# EasyEDA Pro project PCB1.epro

# Board PCB1
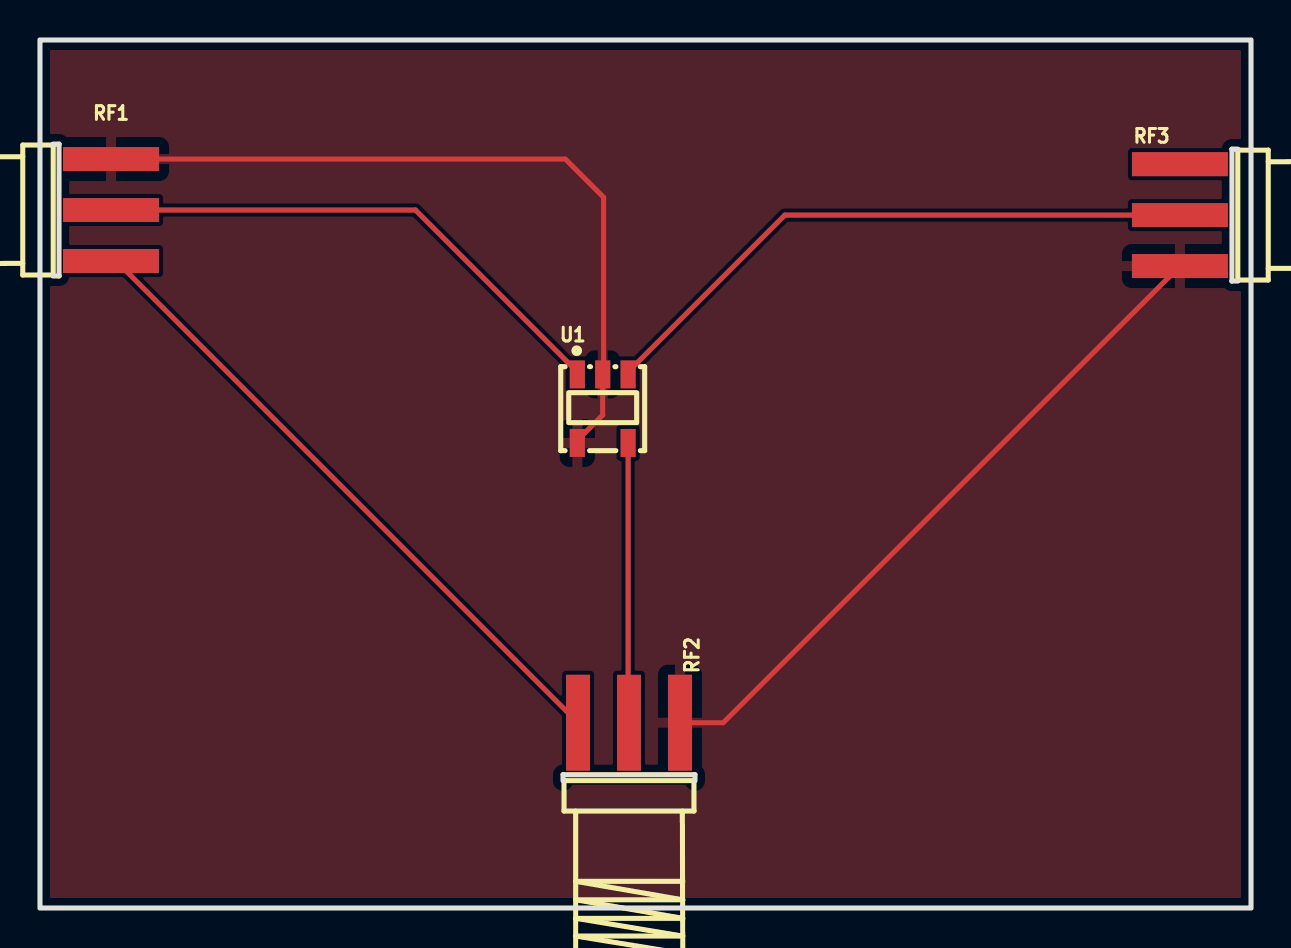
[diagram p0: board, top side]
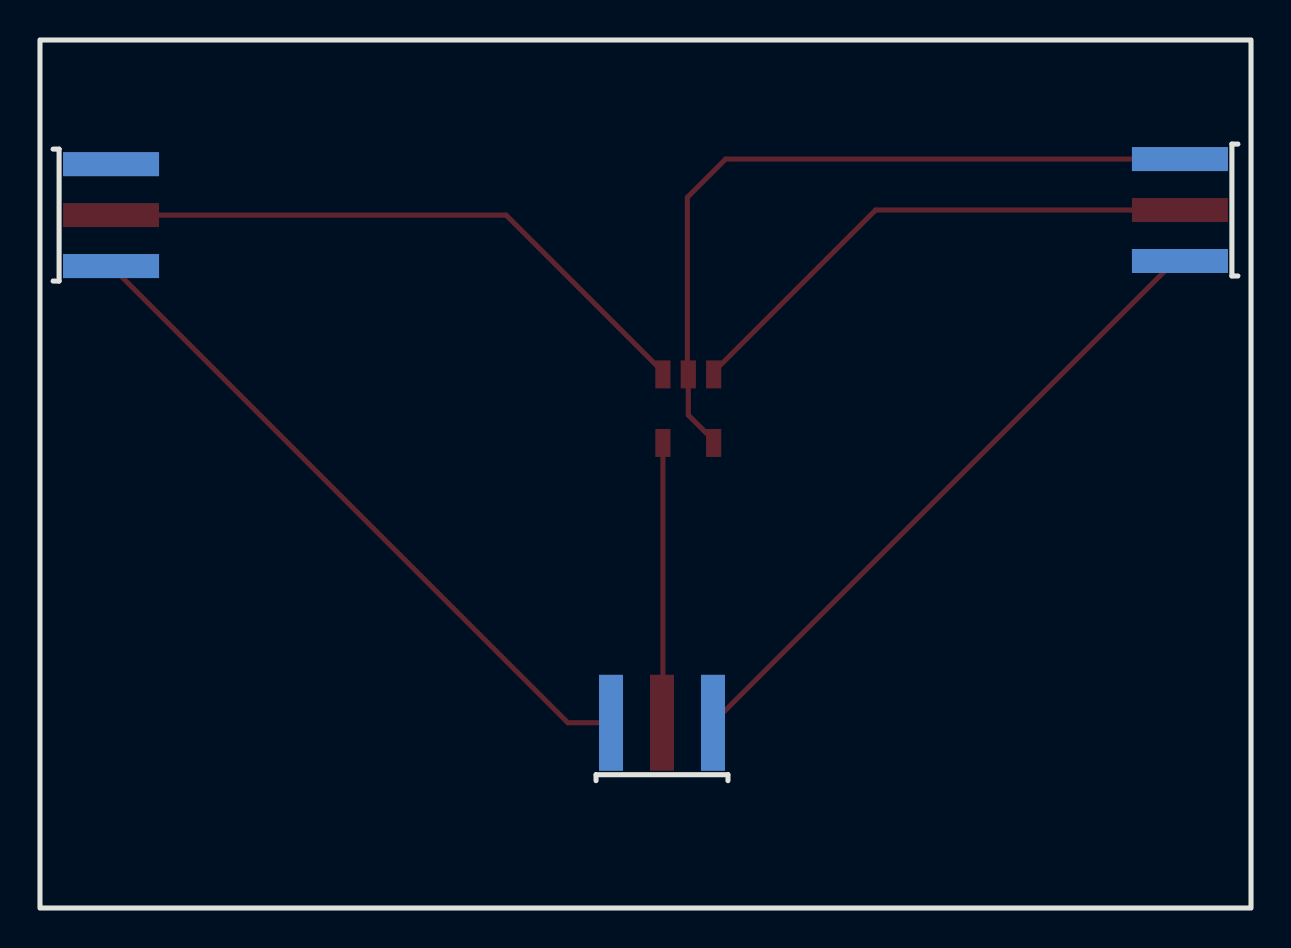
[diagram p1: board, bottom side, seen from below]

Outline 60.58 x 43.43 mm; copper layers: Top Layer, Bottom Layer. Coordinates in mm from the lower left corner of the outline.
Outline path: rectangle 0,43.43 60.58,0
Stack: Top Layer 0.035mm / Dielectric1 1.51mm FR4 er 4.5 / Bottom Layer 0.035mm

## Design rules (mm)
template: JLCPCB Capability(Two Layers Board)
spacing copperThickness1oz (default): track to track 0.102, other pairs 0.152 to 0.3
spacing copperThickness2oz: track to track 0.203, other pairs 0.152 to 0.3
track width copperThickness1oz (default): min 0.127, default 0.254, max 2.54
track width copperThickness2oz: min 0.203, default 0.254, max 2.54
differential pair differentialPair (default): width min 0.127, default 0.254, max 2.54; gap min 0.152, default 0.152
via viaSize (default): diameter min 0.5, default 0.61, max 10; hole min 0.3, default 0.305, max 6.3

## Placement (name value [footprint] x y rotation side)
RF1  BWSMA-KE-P001  [SMA-SMD_BWSMA-KE-P001]  3.56 34.92 180 top
RF2  BWSMA-KE-P001  [SMA-SMD_BWSMA-KE-P001]  29.46 9.27 270 top
RF3  BWSMA-KE-P001  [SMA-SMD_BWSMA-KE-P001]  57.02 34.67 0 top
U1  MABA-010247-2R1250  [XFMR-SMD_MABA-010247-2R1250]  28.15 24.99 0 top

## Footprints (pads in the part's own frame, mm; a bottom-side part is the same pattern mirrored in y, then rotated)
SMA-SMD_BWSMA-KE-P001
  rect 4.8x1.2 smd: 1(0,-2.55) 2(0,2.55) 5(0,0)
  rect 4.8x1.2 smd far side: 3(0,2.55) 4(0,-2.55)
XFMR-SMD_MABA-010247-2R1250
  rect 0.76x1.4 smd: 1(-1.27,1.715) 2(0,1.715) 3(1.27,1.715) 4(1.27,-1.715) 5(-1.27,-1.715)

## Nets
$1N543: RF1.5 U1.1
$1N548: RF2.5 U1.4
$1N676: RF3.5 U1.3
$1N754: RF1.1 RF2.2 RF2.4 RF3.1 U1.2 U1.5

Pads without a net: RF1 2 3 4; RF2 1 3; RF3 2 3 4

## Routing (per net, layer and track width the routed paths; a pad name or vN(x,y) marks a point on that pad's centre or on a via; arc(x,y) is an arc through that point)
(no net): length 32.9
  Top Layer w0.254: RF1.2 3.81,32.38 RF2.1
$1N543: length 26.7
  Top Layer w0.254: RF1.5 18.78,34.92 26.88,26.83
$1N548: length 14.1
  Top Layer w0.254: RF2.5 29.42,9.32 29.42,23.4
$1N676: length 30.9
  Top Layer w0.254: 29.42,26.83 37.26,34.67 RF3.5
$1N754: length 72.6
  Top Layer w0.254: RF2.2 34.17,9.27 RF3.1 ; RF1.1 26.28,37.47 28.19,35.56 28.19,26.87 28.15,26.83 28.15,24.67 26.88,23.4

## Copper pours and planes (outline as drawn; the poured copper is in the pictures)
$1N754 on Top Layer: 0,43.43 60.58,43.43 60.58,0 0,0
